# EasyEDA schematic SCH_projeto-final_2025-07-24.json
TITLE: Sheet_1; REV: 1.0; Date: 2025-07-04; Sheet: 1/1; Drawn By: eliasdigdin; Company: Your Company

## Parts
4.2V  HDR-M-2.54_1x1  [HDR-M-2.54_1X1]
GND  HDR-M-2.54_1x1  [HDR-M-2.54_1X1]
GND_UART  HDR-M-2.54_1x1  [HDR-M-2.54_1X1]
RESISTOR_+  HDR-M-2.54_1x1  [HDR-M-2.54_1X1]
RESISTOR_+1  HDR-M-2.54_1x1  [HDR-M-2.54_1X1]
RESISTOR_-  HDR-M-2.54_1x1  [HDR-M-2.54_1X1]
RESISTOR_-1  HDR-M-2.54_1x1  [HDR-M-2.54_1X1]
RX  HDR-M-2.54_1x1  [HDR-M-2.54_1X1]
SW1  Switch_SW_Push  [CUSTOMBUTTON:CUSTOM_BUTTON]
SW2  Switch_SW_Push  [CUSTOMBUTTON:CUSTOM_BUTTON]
TX  HDR-M-2.54_1x1  [HDR-M-2.54_1X1]
U1  DHT22  [DHT22 HORIZONTAL DHT22_AM2303_HORIZ]
U2  iMCP HTNB32L-XXX  [IMCP HTNB32L-XXX]

## Library data of the parts
4.2V GND GND_UART RESISTOR_+ RESISTOR_+1 RESISTOR_- RESISTOR_-1 RX TX = HDR-M-2.54_1x1: Supplier Part: C81276; Supplier: LCSC; Contributor: LCEDA_Lib
SW1 SW2 = Switch_SW_Push: Add into BOM: yes; Convert to PCB: yes; Origin Footprint: CustomButton:Custom_button; Contributor: rafiqovrashid6628
U1 = DHT22: Contributor: falkpetersen
U2 = iMCP HTNB32L-XXX: Contributor: eliasdigdin

## Nets
GND: GND.1 GND_UART.1 SW1.2 SW2.2 U1.4(GND)
VCC: 4.2V.1 RESISTOR_-.1 RESISTOR_-1.1 U1.1(VCC)
data_dht: U1.2(Data)
GPIO1: RESISTOR_+1.1 SW2.1 U2.7(GPIO1)
GPIO12-Rx: TX.1 U2.14(GPIO12)
GPIO13-tx: RX.1 U2.16(GPIO13)
NRST: RESISTOR_+.1 SW1.1

Not connected (* = marked no-connect by the designer): U1 3(NC); U2 1(uSIM VCC) 2(eSIM VCC) 3(SWD IO) 4(SWD CLK) 5(GPIO4) 6(GPIO5) 8(GND) 9(GPIO3) 10(AON1) 11(CLK_REF) 12(AIO2) 13(GPIO10) 15(GPIO7) 17(vin) 18(vin) 19(GND) 20(GND) 21(GND) 22(WKPO) 23(NRST) 24(AIO4) 25(uSIM_IO) 26(uSIM_IO) 27(uSIM_CLK) 28(eSIM_CLK) 29(GPIO2) 30(GPIO6)

## Notes on the sheet
- Conversor serial uart
- alimentação
